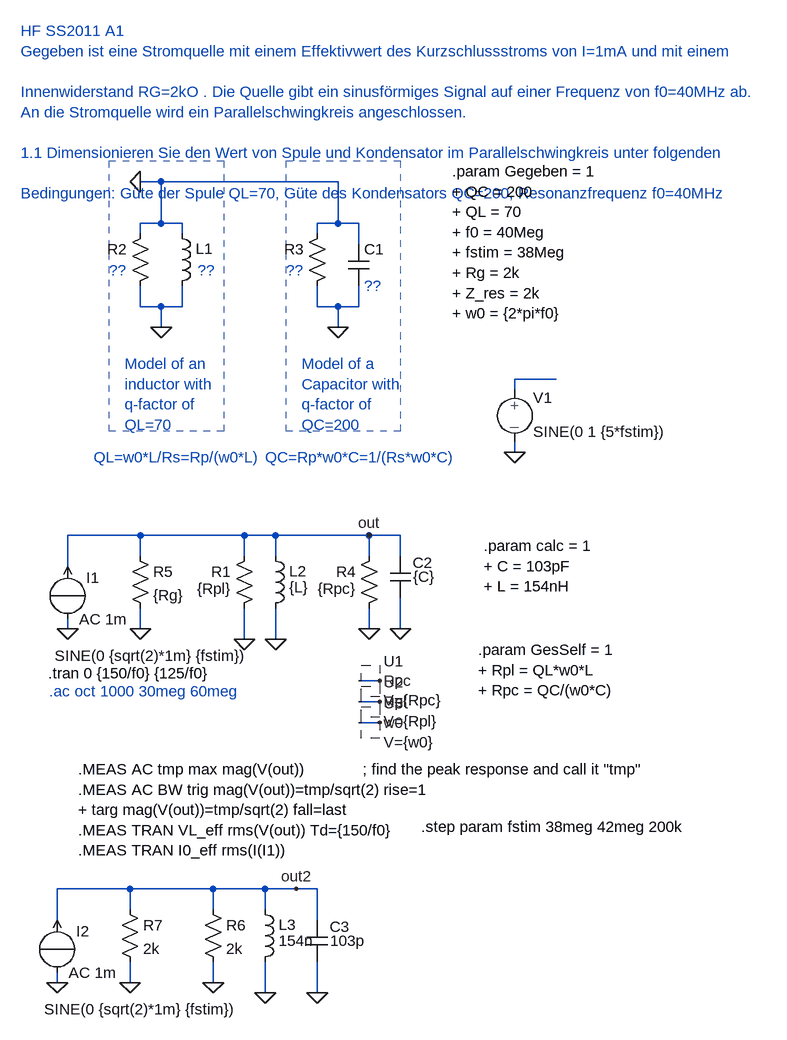
[diagram p0: schematic hf_kl_2011_A1.asc]
hf_kl_2011_A1.asc, the LTspice schematic file:
Version 4
SHEET 1 1260 1304
WIRE 432 16 400 16
WIRE 704 16 432 16
WIRE 432 80 432 16
WIRE 432 80 400 80
WIRE 464 80 432 80
WIRE 704 80 704 16
WIRE 704 80 672 80
WIRE 736 80 704 80
WIRE 400 96 400 80
WIRE 464 96 464 80
WIRE 672 96 672 80
WIRE 736 112 736 80
WIRE 400 208 400 176
WIRE 432 208 400 208
WIRE 464 208 464 176
WIRE 464 208 432 208
WIRE 672 208 672 176
WIRE 704 208 672 208
WIRE 736 208 736 176
WIRE 736 208 704 208
WIRE 432 240 432 208
WIRE 704 240 704 208
WIRE 1040 320 976 320
WIRE 976 336 976 320
WIRE 976 432 976 416
WIRE 400 560 288 560
WIRE 560 560 400 560
WIRE 608 560 560 560
WIRE 752 560 608 560
WIRE 800 560 752 560
WIRE 400 592 400 560
WIRE 560 592 560 560
WIRE 608 592 608 560
WIRE 752 592 752 560
WIRE 800 592 800 560
WIRE 288 608 288 560
WIRE 288 704 288 688
WIRE 400 704 400 672
WIRE 752 704 752 672
WIRE 800 704 800 656
WIRE 560 720 560 672
WIRE 608 720 608 672
WIRE 768 784 736 784
WIRE 768 816 736 816
WIRE 768 848 736 848
WIRE 384 1104 272 1104
WIRE 512 1104 384 1104
WIRE 592 1104 512 1104
WIRE 640 1104 592 1104
WIRE 672 1104 640 1104
WIRE 384 1136 384 1104
WIRE 512 1136 512 1104
WIRE 592 1136 592 1104
WIRE 272 1152 272 1104
WIRE 672 1152 672 1104
WIRE 272 1248 272 1232
WIRE 384 1248 384 1216
WIRE 512 1248 512 1216
WIRE 592 1264 592 1216
WIRE 672 1264 672 1216
FLAG 704 240 0
FLAG 432 240 0
FLAG 400 16 0
FLAG 288 704 0
FLAG 800 704 0
FLAG 400 704 0
FLAG 752 704 0
FLAG 608 720 0
FLAG 560 720 0
FLAG 768 784 Rpc
FLAG 768 816 Rpl
FLAG 768 848 w0
FLAG 752 560 out
FLAG 272 1248 0
FLAG 384 1248 0
FLAG 592 1264 0
FLAG 672 1264 0
FLAG 640 1104 out2
FLAG 512 1248 0
FLAG 976 432 0
SYMBOL ind 448 80 R0
WINDOW 0 37 39 Left 2
WINDOW 3 19 114 Invisible 2
SYMATTR InstName L1
SYMATTR Value 154n
SYMBOL cap 720 112 R0
WINDOW 3 18 83 Invisible 2
SYMATTR InstName C1
SYMATTR Value 103p
SYMBOL MDB_sym\\source-I 288 608 R0
WINDOW 3 -20 137 Left 2
WINDOW 123 18 81 Left 2
WINDOW 39 0 0 Left 2
SYMATTR InstName I1
SYMATTR Value SINE(0 {sqrt(2)*1m} {fstim})
SYMATTR Value2 AC 1m
SYMBOL res 416 80 M0
WINDOW 3 36 76 Invisible 2
SYMATTR InstName R2
SYMATTR Value 1meg
SYMBOL res 688 80 M0
WINDOW 3 36 76 Invisible 2
SYMATTR InstName R3
SYMATTR Value 1meg
SYMBOL ind 592 576 R0
WINDOW 0 37 39 Left 2
WINDOW 3 37 64 Left 2
SYMATTR InstName L2
SYMATTR Value {L}
SYMBOL cap 784 592 R0
WINDOW 0 35 10 Left 2
WINDOW 3 36 32 Left 2
SYMATTR InstName C2
SYMATTR Value {C}
SYMBOL res 576 576 M0
WINDOW 3 36 66 Left 2
SYMATTR InstName R1
SYMATTR Value {Rpl}
SYMBOL res 768 576 M0
WINDOW 3 36 66 Left 2
SYMATTR InstName R4
SYMATTR Value {Rpc}
SYMBOL res 384 576 R0
SYMATTR InstName R5
SYMATTR Value {Rg}
SYMBOL MDB_sym\\source-Vmarker 736 784 R0
SYMATTR Value V={Rpc}
SYMATTR InstName U1
SYMBOL MDB_sym\\source-Vmarker 736 816 R0
SYMATTR Value V={Rpl}
SYMATTR InstName U2
SYMBOL MDB_sym\\source-Vmarker 736 848 R0
SYMATTR Value V={w0}
SYMATTR InstName U3
SYMBOL MDB_sym\\source-I 272 1152 R0
WINDOW 3 -20 137 Left 2
WINDOW 123 18 81 Left 2
WINDOW 39 0 0 Left 2
SYMATTR InstName I2
SYMATTR Value SINE(0 {sqrt(2)*1m} {fstim})
SYMATTR Value2 AC 1m
SYMBOL ind 576 1120 R0
WINDOW 0 37 39 Left 2
WINDOW 3 37 64 Left 2
SYMATTR InstName L3
SYMATTR Value 154n
SYMBOL res 368 1120 R0
SYMATTR InstName R7
SYMATTR Value 2k
SYMBOL cap 656 1152 R0
WINDOW 0 35 10 Left 2
WINDOW 3 36 32 Left 2
SYMATTR InstName C3
SYMATTR Value 103p
SYMBOL res 496 1120 R0
SYMATTR InstName R6
SYMATTR Value 2k
SYMBOL MDB_sym\\source-V 976 320 R0
WINDOW 123 0 0 Left 2
WINDOW 39 0 0 Left 2
SYMATTR InstName V1
SYMATTR Value SINE(0 1 {5*fstim})
TEXT 260 800 Left 2 ;.ac oct 1000 30meg 60meg
TEXT 258 772 Left 2 !.tran 0 {150/f0} {125/f0}
TEXT 376 296 Left 2 ;Model of an\ninductor with\nq-factor of \nQL=70
TEXT 648 296 Left 2 ;Model of a\nCapacitor with\nq-factor of \nQC=200
TEXT 328 440 Left 2 ;QL=w0*L/Rs=Rp/(w0*L)
TEXT 592 440 Left 2 ;QC=Rp*w0*C=1/(Rs*w0*C)
TEXT 624 152 Left 2 ;??
TEXT 352 152 Left 2 ;??
TEXT 488 152 Left 2 ;??
TEXT 744 176 Left 2 ;??
TEXT 216 -216 Left 2 ;HF SS2011 A1\nGegeben ist eine Stromquelle mit einem Effektivwert des Kurzschlussstroms von I=1mA und mit einem \n\nInnenwiderstand RG=2kO . Die Quelle gibt ein sinusförmiges Signal auf einer Frequenz von f0=40MHz ab. \nAn die Stromquelle wird ein Parallelschwingkreis angeschlossen.  \n\n1.1 Dimensionieren Sie den Wert von Spule und Kondensator im Parallelschwingkreis unter folgenden \n\nBedingungen: Güte der Spule QL=70, Güte des Kondensators QC=200, Resonanzfrequenz f0=40MHz
TEXT 880 0 Left 2 !.param Gegeben = 1\n+ QC = 200\n+ QL = 70\n+ f0 = 40Meg\n+ fstim = 38Meg\n+ Rg = 2k\n+ Z_res = 2k\n+ w0 = {2*pi*f0}
TEXT 920 736 Left 2 !.param GesSelf = 1\n+ Rpl = QL*w0*L\n+ Rpc = QC/(w0*C)
TEXT 928 576 Left 2 !.param calc = 1\n+ C = 103pF\n+ L = 154nH
TEXT 304 920 Left 2 !.MEAS AC tmp max mag(V(out))             ; find the peak response and call it "tmp" \n.MEAS AC BW trig mag(V(out))=tmp/sqrt(2) rise=1\n+ targ mag(V(out))=tmp/sqrt(2) fall=last\n.MEAS TRAN VL_eff rms(V(out)) Td={150/f0}\n.MEAS TRAN I0_eff rms(I(I1))
TEXT 832 1008 Left 2 !.step param fstim 38meg 42meg 200k
RECTANGLE Normal 528 400 352 -16 2
RECTANGLE Normal 800 400 624 -16 2

The netlist it stands for:
* hf_kl_2011_A1.asc
L1 0 0 154n
C1 0 0 103p
I1 0 out SINE(0 {sqrt(2)*1m} {fstim}) AC 1m
R2 0 0 1meg
R3 0 0 1meg
L2 out 0 {L}
C2 out 0 {C}
R1 out 0 {Rpl}
R4 out 0 {Rpc}
R5 out 0 {Rg}
* U1: V={Rpc} (symbol MDB_sym\source-Vmarker not available, pin order unknown); nets seen at it: Rpc
* U2: V={Rpl} (symbol MDB_sym\source-Vmarker not available, pin order unknown); nets seen at it: Rpl
* U3: V={w0} (symbol MDB_sym\source-Vmarker not available, pin order unknown); nets seen at it: w0
I2 0 out2 SINE(0 {sqrt(2)*1m} {fstim}) AC 1m
L3 out2 0 154n
R7 out2 0 2k
C3 out2 0 103p
R6 out2 0 2k
V1 N001 0 SINE(0 1 {5*fstim})
* .ac oct 1000 30meg 60meg
.tran 0 {150/f0} {125/f0}
* Model of an
* inductor with
* q-factor of
* QL=70
* Model of a
* Capacitor with
* q-factor of
* QC=200
* QL=w0*L/Rs=Rp/(w0*L)
* QC=Rp*w0*C=1/(Rs*w0*C)
* ??
* ??
* ??
* ??
* HF SS2011 A1
* Gegeben ist eine Stromquelle mit einem Effektivwert des Kurzschlussstroms von I=1mA und mit einem
* Innenwiderstand RG=2kO . Die Quelle gibt ein sinusförmiges Signal auf einer Frequenz von f0=40MHz ab.
* An die Stromquelle wird ein Parallelschwingkreis angeschlossen.
* 1.1 Dimensionieren Sie den Wert von Spule und Kondensator im Parallelschwingkreis unter folgenden
* Bedingungen: Güte der Spule QL=70, Güte des Kondensators QC=200, Resonanzfrequenz f0=40MHz
.param Gegeben = 1
+ QC = 200
+ QL = 70
+ f0 = 40Meg
+ fstim = 38Meg
+ Rg = 2k
+ Z_res = 2k
+ w0 = {2*pi*f0}
.param GesSelf = 1
+ Rpl = QL*w0*L
+ Rpc = QC/(w0*C)
.param calc = 1
+ C = 103pF
+ L = 154nH
.MEAS AC tmp max mag(V(out))             ; find the peak response and call it "tmp"
.MEAS AC BW trig mag(V(out))=tmp/sqrt(2) rise=1
+ targ mag(V(out))=tmp/sqrt(2) fall=last
.MEAS TRAN VL_eff rms(V(out)) Td={150/f0}
.MEAS TRAN I0_eff rms(I(I1))
.step param fstim 38meg 42meg 200k
.backanno
.end